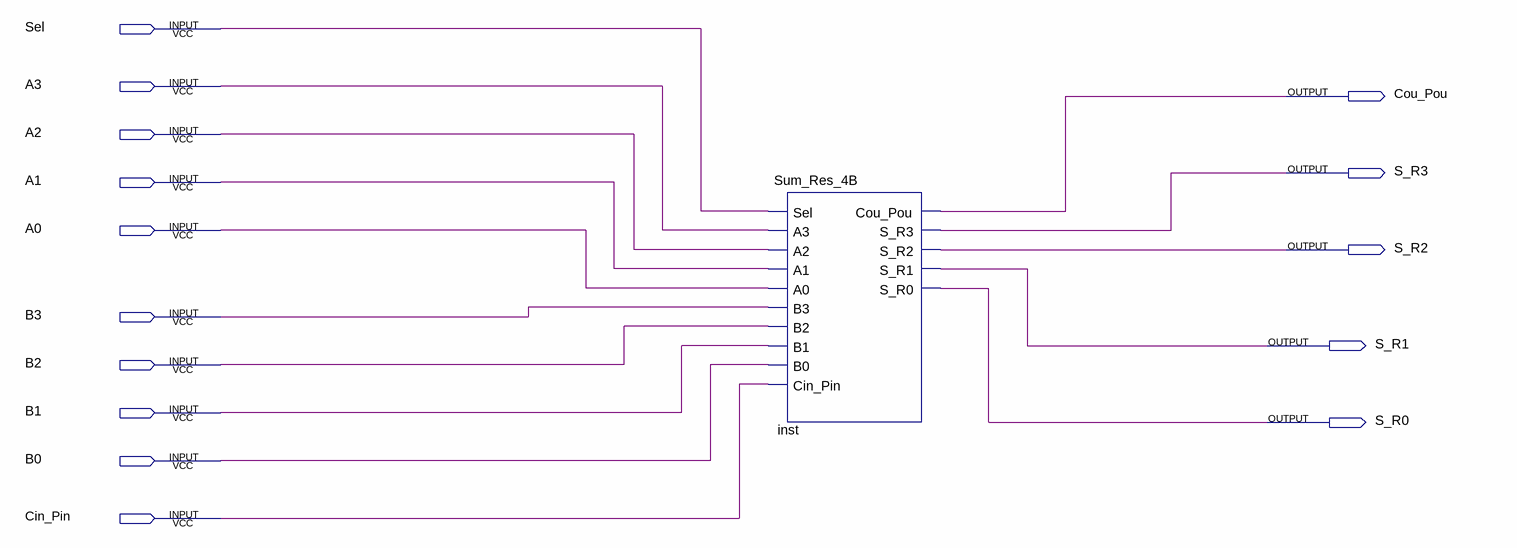
[diagram p0: schematic sheet]
// Quartus schematic Sum_Tes_4B_E.bdf as structural Verilog: 1 symbols, 15 pins
module Sum_Tes_4B_E (
  input  Sel,
  input  A3,
  input  A2,
  input  A1,
  input  A0,
  input  B3,
  input  B2,
  input  B1,
  input  B0,
  input  Cin_Pin,
  output Cou_Pou,
  output S_R3,
  output S_R2,
  output S_R1,
  output S_R0
);

  Sum_Res_4B inst (
    .Sel(Sel), .A3(A3), .A2(A2), .A1(A1), .A0(A0), .B3(B3), .B2(B2), .B1(B1), .B0(B0), .Cin_Pin(Cin_Pin),
    .Cou_Pou(Cou_Pou), .S_R3(S_R3), .S_R2(S_R2), .S_R1(S_R1), .S_R0(S_R0));
endmodule
